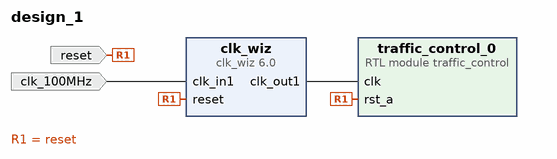
[diagram p0: block diagram of the top level]
# Vivado block design design_1, xc7a200tfbg676-2, Vivado 2022.1
create_bd_design design_1

create_bd_port -dir I -type clk clk_100MHz
set_property -dict {CONFIG.FREQ_HZ 100000000} [get_bd_ports clk_100MHz]
create_bd_port -dir I -type rst reset
set_property -dict {CONFIG.POLARITY ACTIVE_HIGH} [get_bd_ports reset]

create_bd_cell -type module -reference traffic_control traffic_control_0
create_bd_cell -type ip -vlnv xilinx.com:ip:clk_wiz:6.0 clk_wiz
set_property -dict {CONFIG.RESET_BOARD_INTERFACE reset CONFIG.USE_BOARD_FLOW true} [get_bd_cells clk_wiz]

# ---- connections ----

connect_bd_net [get_bd_ports clk_100MHz] [get_bd_pins clk_wiz/clk_in1]
connect_bd_net [get_bd_pins clk_wiz/clk_out1] [get_bd_pins traffic_control_0/clk]
connect_bd_net [get_bd_ports reset] [get_bd_pins clk_wiz/reset] [get_bd_pins traffic_control_0/rst_a]

validate_bd_design
save_bd_design
